# Altium schematic sheet WS485H-V5_RS.SchDoc: WS485H-V1
size A2; Author: Fred; PageSetup: Record=PageOptions|CenterHorizontal=True|CenterVertical=True|PrintScale=1.04|XCorrection=1.00|YCorrection=1.00|PrintKind=0|BorderSize=5000000|LeftOffset=0|BottomOffset=0|Orientation=1|PaperLength=1000|PaperWidth=1000|Scale=100|PaperSource=7|PrintQuality=-4|MediaType=1|DitherType=10|PaperKind=A3|PrintScaleMode=1
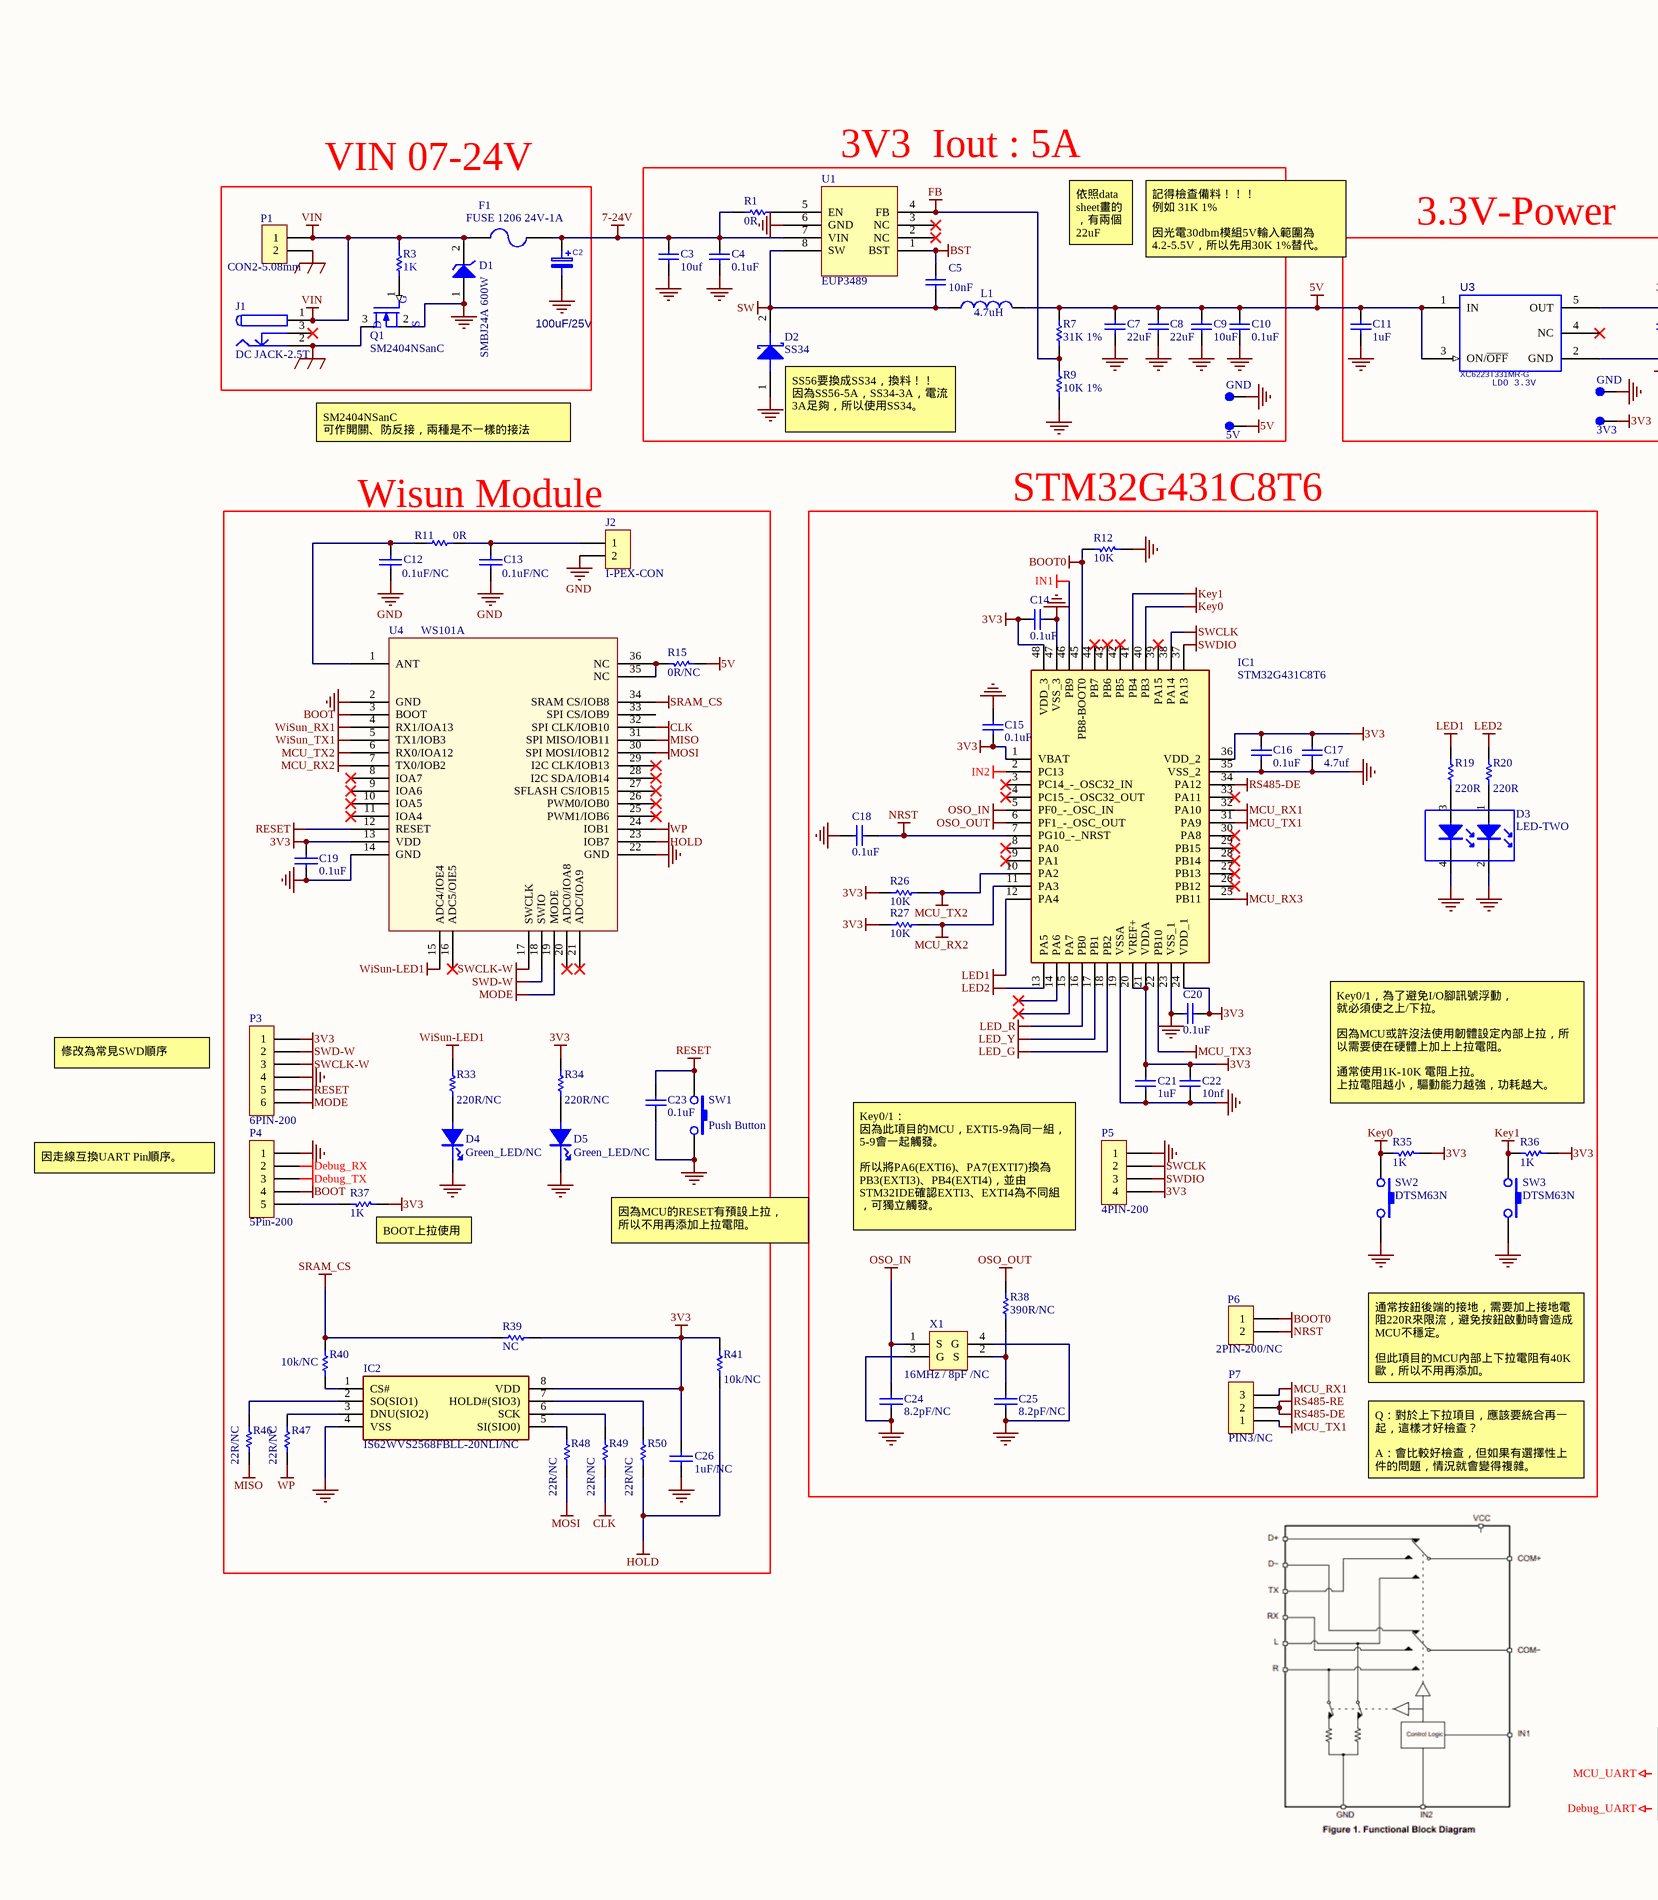
[diagram p0: WS485H-V5_RS.SchDoc, left]
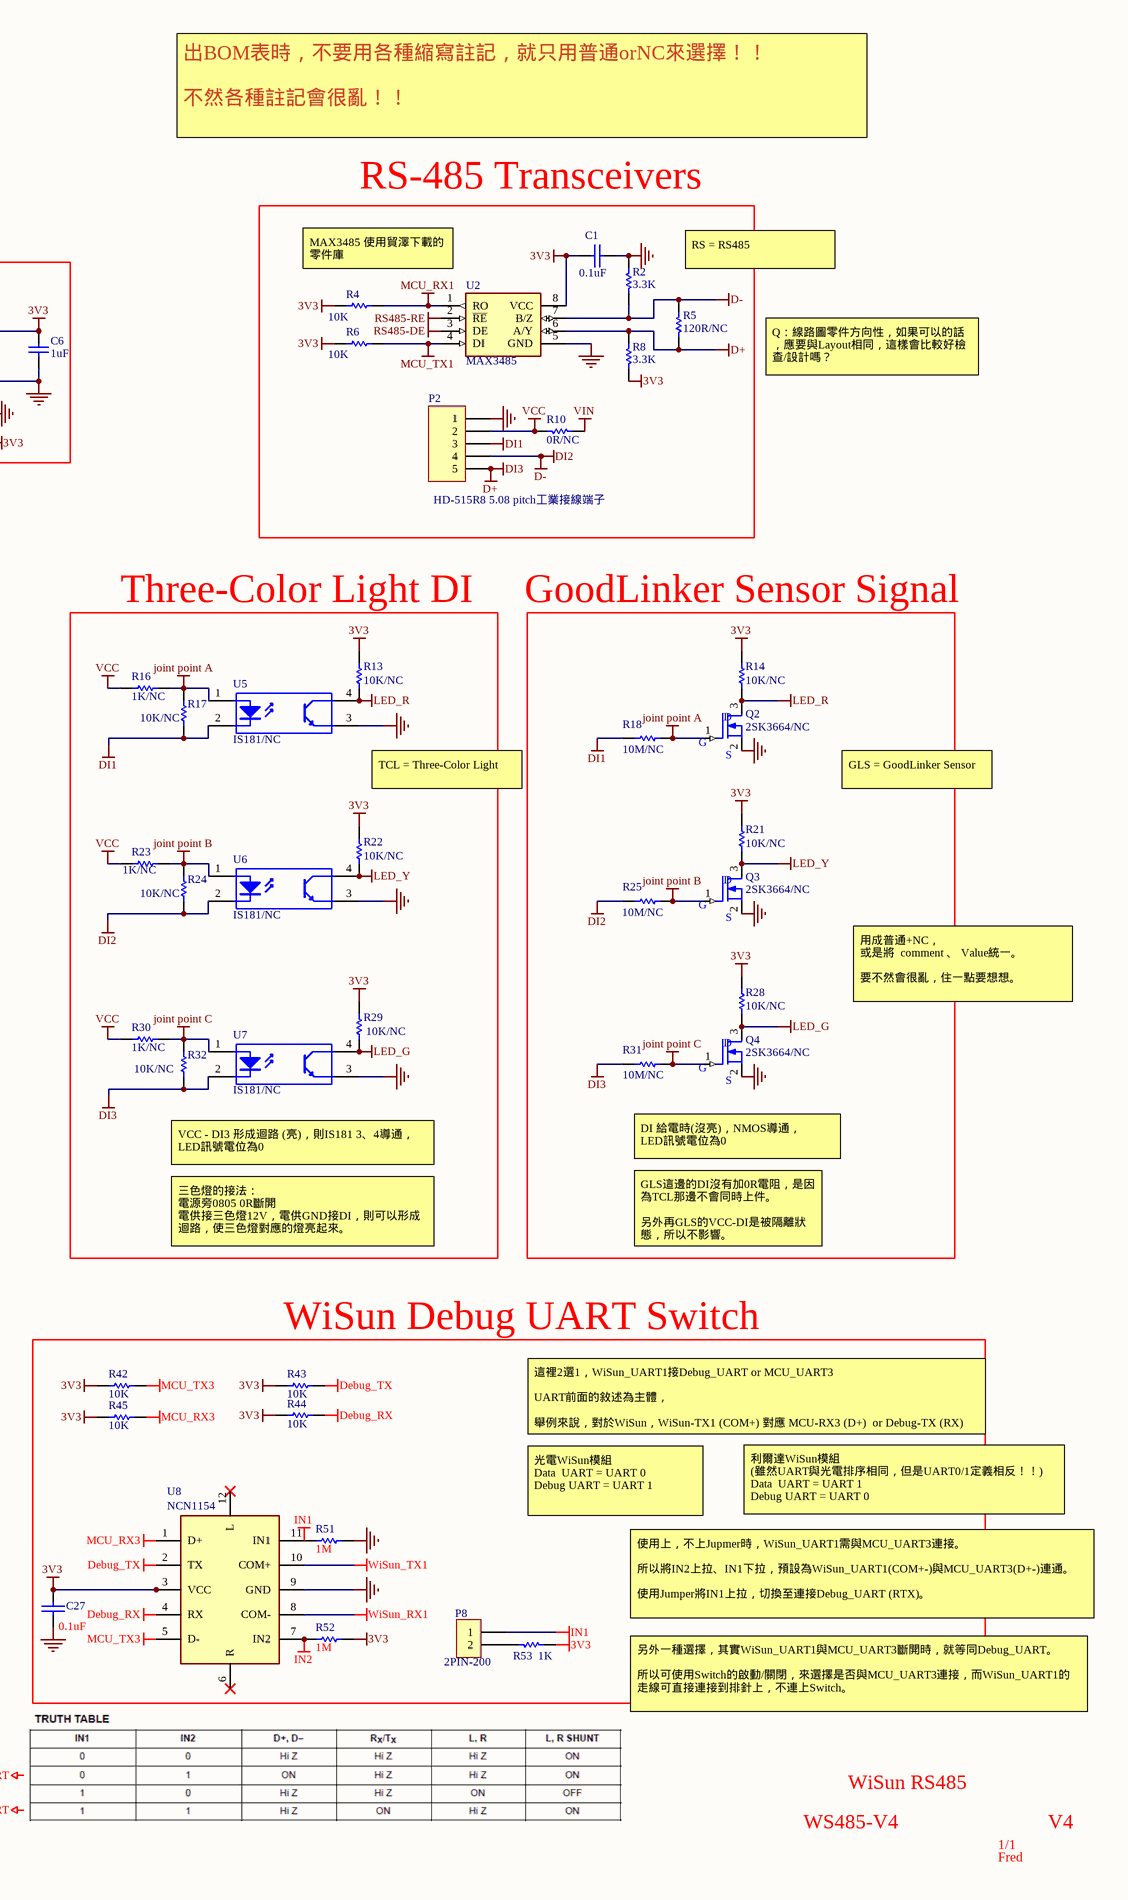
[diagram p1: WS485H-V5_RS.SchDoc, right]

## Parts
=Value1  GND  [TESTPAD-1.5X0.6MM]
=Value2  GND  [TESTPAD-1.5X0.6MM]
=Value3  3V3  [TESTPAD-1.5X0.6MM]
=Value4  5V  [TESTPAD-1.5X0.6MM]
C1  0.1uF  [0402C]
C2  100uF/25V  [DIP CAP-8*3.5]
C3  10uf  [0603C]
C4  0.1uF  [0603C]
C5  10nF  [0603C]
C6  1uF  [0603C]
C7  22uF  [0805C]
C8  22uF  [0805C]
C9  10uF  [0603C]
C10  0.1uF  [0603C]
C11  1uF  [0603C]
C12  0.1uF/NC  [0402C]
C13  0.1uF/NC  [0402C]
C14  0.1uF  [0402C]
C15  0.1uF  [0402C]
C16  0.1uF  [0402C]
C17  4.7uf  [0402C]
C18  0.1uF  [0402C]
C19  0.1uF  [0402C]
C20  0.1uF  [0402C]
C21  1uF  [0402C]
C22  10nf  [0402C]
C23  0.1uF  [0402C]
C24  8.2pF/NC  [0402C]
C25  8.2pF/NC  [0402C]
C26  1uF/NC  [0402C]
C27  0.1uF  [0402C]
D1  SMBJ24A 600W  [SMBJ40CA(TVS)]
D2  SS34  [SMBJ40CA(TVS)]
D3  LED-TWO  [LEDX2HOLD]
D4  Green_LED/NC  [LED0603--0.4mm]
D5  Green_LED/NC  [LED0603--0.4mm]
F1  FUSE 1206 24V-1A  [1206-FUSE]
IC1  STM32G431C8T6  [QFP50P900X900X160-48N]
IC2  IS62WVS2568FBLL-20NLI/NC  [SOIC127P600X175-8N]
J1  DC JACK-2.5T  [DC JACK-2.5T-NEW]
J2  I-PEX-CON  [I-PEX-CON]
L1  4.7uH  [L7X6.6]
P1  CON2-5.08mm  [OQ5.08-90D-2P]
P2  HD-515R8 5.08 pitch工業接線端子  [OQ5.08-90D-5P]
P3  6PIN-200  [6pin-200_1.3_0.6]
P4  5Pin-200  [5pin-200_1.3_0.6]
P5  4PIN-200  [4PIN-200_1.3_0.6]
P6  2PIN-200/NC  [2PIN-200_1.3_0.6]
P7  PIN3/NC  [3PIN-200_1.3_0.6]
P8  2PIN-200  [2PIN-200_1.3_0.6]
Q1  SM2404NSanC  [SOT-23]
Q2  2SK3664/NC  [SOT-23]
Q3  2SK3664/NC  [SOT-23]
Q4  2SK3664/NC  [SOT-23]
R1  0R  [0603]
R2  3.3K  [0603]
R3  1K  [0603]
R4  10K  [0402]
R5  120R/NC  [0603]
R6  10K  [0402]
R7  31K 1%  [0603]
R8  3.3K  [0603]
R9  10K 1%  [0603]
R10  0R/NC  [0805]
R11  0R  [0603]
R12  10K  [0402]
R13  10K/NC  [0402]
R14  10K/NC  [0402]
R15  0R/NC  [0805]
R16  1K/NC  [0402]
R17  10K/NC  [0402]
R18  10M/NC  [0402]
R19  220R  [0603]
R20  220R  [0603]
R21  10K/NC  [0402]
R22  10K/NC  [0402]
R23  1K/NC  [0402]
R24  10K/NC  [0402]
R25  10M/NC  [0402]
R26  10K  [0402]
R27  10K  [0402]
R28  10K/NC  [0402]
R29  10K/NC  [0402]
R30  1K/NC  [0402]
R31  10M/NC  [0402]
R32  10K/NC  [0402]
R33  220R/NC  [0402]
R34  220R/NC  [0402]
R35  1K  [0402]
R36  1K  [0402]
R37  1K  [0402]
R38  390R/NC  [0402]
R39  NC  [0402]
R40  10k/NC  [0402]
R41  10k/NC  [0402]
R42  10K  [0402]
R43  10K  [0402]
R44  10K  [0402]
R45  10K  [0402]
R46  22R/NC  [0402]
R47  22R/NC  [0402]
R48  22R/NC  [0402]
R49  22R/NC  [0402]
R50  22R/NC  [0402]
R51  1M  [0402]
R52  1M  [0402]
R53  1K  [0402]
SW1  Push Button  [Button_2pin-3*4*2MM]
SW2  DTSM63N  [SW-AT-1102VT1-new]
SW3  DTSM63N  [SW-AT-1102VT1-new]
U1  EUP3489  [MOS SOP8]
U2  MAX3485  [SOIC127P600X175-8N]
U3  XC6223T331MR-G  [SOT-23-5-0.95MM]
U4  WS101A  [WS101A]
U5  IS181/NC  [IS181-SMD]
U6  IS181/NC  [IS181-SMD]
U7  IS181/NC  [IS181-SMD]
U8  NCN1154  [IC_TXB0104RUTR]
X1  16MHz / 8pF /NC  [XTAL-SMD-20*16]

## Blocks framed on the sheet
VIN 07-24V: C2 D1 F1 J1 P1 Q1 R3
3V3  Iout : 5A: =Value2 =Value4 C3-C5 C7-C10 D2 L1 R1 R7 R9 U1
RS-485 Transceivers: C1 P2 R2 R4-R6 R8 R10 U2
3.3V-Power: =Value1 =Value3 C6 C11 U3
Wisun Module: C12 C13 C19 C23 C26 D4 D5 IC2 J2 P3 P4 R11 R15 R33 R34 R37 R39-R41 R46-R50 SW1 U4
STM32G431C8T6: C14-C18 C20-C22 C24 C25 D3 IC1 P5-P7 R12 R19 R20 R26 R27 R35 R36 R38 SW2 SW3 X1
Three-Color Light DI: R13 R16 R17 R22-R24 R29 R30 R32 U5-U7
WiSun Debug UART Switch: C27 P8 R42-R45 R51-R53 U8

## Nets
3V3: =Value3.1 C1.2 C6.2 C14.2 C15.2 C16.1 C17.1 C19.2 C20.2 C21.1 C22.1 C26.2 C27.1 IC1.1(VBAT) IC1.20(VREF+) IC1.21(VDDA) IC1.24(VDD_1) IC1.36(VDD_2) IC1.48(VDD_3) IC2.8(VDD) P3.1 P5.4 R4.2 R6.2 R8.2 R13.2 R14.2 R21.2 R22.2 R26.2 R27.2 R28.2 R29.2 R34.2 R35.1 R36.1 R37.1 R39.1 R41.2 R42.2 R43.2 R44.2 R45.2 R52.1 R53.1 U2.8(VCC) U3.5(OUT) U4.13(VDD) U8.3(VCC)
5V: =Value4.1 C7.2 C8.2 C9.2 C10.2 C11.2 L1.2 R7.2 R15.1 U3.1(IN) U3.3(ON/~{OFF})
7-24V: C2.1 C3.2 C4.2 F1.2 R1.1 U1.7(VIN)
BOOT: P4.4 U4.3(BOOT)
BOOT0: IC1.45(PB8-BOOT0) P6.1 R12.2
BST: C5.1 U1.1(BST)
CLK: R49.1 U4.32(SPI_CLK/IOB10)
D+: P2.5 R5.2 R8.1 R31.2 R32.1 U2.6(A/Y) U7.2  [also labelled DI3]
D-: P2.4 R2.2 R5.1 R24.1 R25.2 U2.7(B/Z) U6.2  [also labelled DI2]
Debug_RX: P4.2 R44.1 U8.4(RX)
Debug_TX: P4.3 R43.1 U8.2(TX)
DI1: P2.3 R17.1 R18.2 U5.2
FB: R7.1 R9.2 U1.4(FB)
GND: =Value1.1 =Value2.1 C1.1 C2.2 C3.1 C4.1 C6.1 C7.1 C8.1 C9.1 C10.1 C11.1 C12.1 C13.1 C14.1 C15.1 C16.2 C17.2 C18.2 C19.1 C20.1 C21.2 C22.2 C23.2 C24.2 C25.2 C26.1 C27.2 D1.1 D2.1 D3.2 D3.4 D4.2 D5.2 IC1.19(VSSA) IC1.23(VSS_1) IC1.35(VSS_2) IC1.47(VSS_3) IC2.4(VSS) J2.2 P2.1 P3.4 P4.1 P5.1 Q1.2(SOURCE) Q2.2(SOURCE) Q3.2(SOURCE) Q4.2(SOURCE) R2.1 R9.1 R12.1 R51.1 SW1.2 SW2.0(GND) SW2.2 SW3.0(GND) SW3.2 U1.6(GND) U2.5(GND) U3.2(GND) U4.2(GND) U4.14(GND) U4.22(GND) U5.3 U6.3 U7.3 U8.9(GND) X1.3(G) X1.4(G)
HOLD: R41.1 R50.1 U4.23(IOB7)
IN1: IC1.46(PB9) P8.1 R51.2 U8.11(IN1)
IN2: IC1.2(PC13) R52.2 U8.7(IN2)
joint point A: Q2.1(GATE) R16.2 R17.2 R18.1 U5.1
joint point B: Q3.1(GATE) R23.2 R24.2 R25.1 U6.1
joint point C: Q4.1(GATE) R30.2 R31.1 R32.2 U7.1
Key0: IC1.40(PB3) R35.2 SW2.1
Key1: IC1.41(PB4) R36.2 SW3.1
LED1: IC1.12(PA4) R19.2
LED2: IC1.13(PA5) R20.2
LED_G: IC1.18(PB2) Q4.3(DRAIN) R28.1 R29.1 U7.4
LED_R: IC1.16(PB0) Q2.3(DRAIN) R13.1 R14.1 U5.4
LED_Y: IC1.17(PB1) Q3.3(DRAIN) R21.1 R22.1 U6.4
MCU_RX1: IC1.32(PA10) P7.3 R4.1 U2.1(RO)
MCU_RX2: IC1.11(PA3) R27.1 U4.7(TX0/IOB2)
MCU_RX3: IC1.25(PB11) R45.1 U8.1(D+)
MCU_TX1: IC1.31(PA9) P7.1 R6.1 U2.4(DI)
MCU_TX2: IC1.10(PA2) R26.1 U4.6(RX0/IOA12)
MCU_TX3: IC1.22(PB10) R42.1 U8.5(D-)
MISO: R46.2 U4.31(SPI_MISO/IOB11)
MODE: P3.6 U4.19(MODE)
MOSI: R48.1 U4.30(SPI_MOSI/IOB12)
NRST: C18.1 IC1.7(PG10_-_NRST) P6.2
OSO_IN: C24.1 IC1.5(PF0_-_OSC_IN) X1.1(S)
OSO_OUT: IC1.6(PF1_-_OSC_OUT) R38.1
PGND: J1.2 P1.2 Q1.3(DRAIN)
RESET: C23.1 P3.5 SW1.1 U4.12(RESET)
RS485-DE: IC1.34(PA12) P7.2 U2.2(~{RE}) U2.3(DE)  [also labelled RS485-RE]
SRAM_CS: R39.2 R40.1 U4.34(SRAM_CS/IOB8)
SW: C5.2 D2.2 L1.1 U1.8(SW)
SWCLK: IC1.38(PA14) P5.2
SWCLK-W: P3.3 U4.17(SWCLK)
SWD-W: P3.2 U4.18(SWIO)
SWDIO: IC1.37(PA13) P5.3
VCC: P2.2 R10.2 R16.1 R23.1 R30.1
VIN: D1.2 F1.1 J1.1 P1.1 R3.2 R10.1
WiSun-LED1: R33.2 U4.15(ADC4/IOE4)
WiSun_RX1: U4.4(RX1/IOA13) U8.8(COM-)
WiSun_TX1: U4.5(TX1/IOB3) U8.10(COM+)
WP: R47.1 U4.24(IOB1)
NetC12_2: C12.2 R11.1 U4.1(ANT)
NetC13_2: C13.2 J2.1 R11.2
NetC25_1: C25.1 R38.2 X1.2(S)
NetD3_1: D3.1 R20.1
NetD3_3: D3.3 R19.1
NetD4_1: D4.1 R33.1
NetD5_1: D5.1 R34.1
NetIC2_1: IC2.1(CS#) R40.2
NetIC2_2: IC2.2(SO(SIO1)) R46.1
NetIC2_3: IC2.3(DNU(SIO2)) R47.2
NetIC2_5: IC2.5(SI(SIO0)) R48.2
NetIC2_6: IC2.6(SCK) R49.2
NetIC2_7: IC2.7(HOLD#(SIO3)) R50.2
NetP4_5: P4.5 R37.2
NetP8_2: P8.2 R53.2
NetQ1_1: Q1.1(GATE) R3.1
NetR1_2: R1.2 U1.5(EN)
NetR15_2: R15.2 U4.35(NC) U4.36(NC)

Not connected (* = marked no-connect by the designer): IC1 3(PC14_-_OSC32_IN)* 4(PC15_-_OSC32_OUT)* 8(PA0)* 9(PA1)* 14(PA6)* 15(PA7)* 26(PB12)* 27(PB13)* 28(PB14)* 29(PB15)* 30(PA8)* 33(PA11)* 39(PA15)* 42(PB5)* 43(PB6)* 44(PB7)*; J1 3*; U1 2(NC)* 3(NC)*; U3 4(NC)*; U4 8(IOA7)* 9(IOA6)* 10(IOA5)* 11(IOA4)* 16(ADC5/OIE5)* 20(ADC0/IOA8)* 21(ADC/IOA9)* 25(PWM1/IOB6)* 26(PWM0/IOB0)* 27(SFLASH_CS/IOB15)* 28(I2C_SDA/IOB14)* 29(I2C_CLK/IOB13)* 33(SPI_CS/IOB9); U8 6(R)* 12(L)*

## Notes on the sheet
- 出BOM表時，不要用各種縮寫註記，就只用普通orNC來選擇！！
  不然各種註記會很亂！！
- 依照data sheet畫的，有兩個22uF
- 記得檢查備料！！！
  例如 31K 1%
  因光電30dbm模組5V輸入範圍為4.2-5.5V，所以先用30K 1%替代。
- MAX3485 使用貿澤下載的零件庫
- RS = RS485
- 注意事項！！！！！
  WS101A 沒用到的pin原本的零件庫有畫錯
  RS485料號要改！！！ ISL3178EIBZ-T
  0603 120K 1% 改為 127K 1%，輸出為3.32V 正常 ！！！
- (near U3) LDO 3.3V
- Q：線路圖零件方向性，如果可以的話，應要與Layout相同，這樣會比較好檢查/設計嗎？
- SM2404NSanC
  可作開關、防反接，兩種是不一樣的接法
- (near D2) SS56要換成SS34，換料！！
  因為SS56-5A，SS34-3A，電流3A足夠，所以使用SS34。
- (near =Value4) 22uF 雖然0603有料，不過0805比較便宜！！
- "Si2306DS" 換料成 "SM2404NSanC"
- GoodLinker Sensor Signal
- TCL = Three-Color Light
- GLS = GoodLinker Sensor
- 用成普通+NC，
  或是將  comment 、 Value統一。
  要不然會很亂，住一點要想想。
- 修改為常見SWD順序
- Key0/1，為了避免I/O腳訊號浮動，
  就必須使之上/下拉。
  因為MCU或許沒法使用韌體設定內部上拉，所以需要使在硬體上加上上拉電阻。
  通常使用1K-10K 電阻上拉。
  上拉電阻越小，驅動能力越強，功耗越大。
- VCC - DI3 形成迴路 (亮)，則IS181 3、4導通，
  LED訊號電位為0
- DI 給電時(沒亮)，NMOS導通，
  LED訊號電位為0
- 因走線互換UART Pin順序。
- Key0/1：
  因為此項目的MCU，EXTI5-9為同一組，5-9會一起觸發。
  所以將PA6(EXTI6)、PA7(EXTI7)換為PB3(EXTI3)、PB4(EXTI4)，並由STM32IDE確認EXTI3、EXTI4為不同組，可獨立觸發。
- (near R37) BOOT上拉使用
- 因為MCU的RESET有預設上拉，
  所以不用再添加上拉電阻。
- 三色燈的接法：
  電源旁0805 0R斷開
  電供接三色燈12V，電供GND接DI，則可以形成迴路，使三色燈對應的燈亮起來。
- GLS這邊的DI沒有加0R電阻，是因為TCL那邊不會同時上件。
  另外再GLS的VCC-DI是被隔離狀態，所以不影響。
- 通常按鈕後端的接地，需要加上接地電阻220R來限流，避免按鈕啟動時會造成MCU不穩定。
  但此項目的MCU內部上下拉電阻有40K歐，所以不用再添加。
- 這裡2選1，WiSun_UART1接Debug_UART or MCU_UART3
  UART前面的敘述為主體，
  舉例來說，對於WiSun，WiSun-TX1 (COM+) 對應 MCU-RX3 (D+)  or Debug-TX (RX)
- Q：對於上下拉項目，應該要統合再一起，這樣才好檢查？
  A：會比較好檢查，但如果有選擇性上件的問題，情況就會變得複雜。
- 光電WiSun模組
  Data  UART = UART 0
  Debug UART = UART 1
- 利爾達WiSun模組
  (雖然UART與光電排序相同，但是UART0/1定義相反！！)
  Data  UART = UART 1
  Debug UART = UART 0
- 使用上，不上Jupmer時，WiSun_UART1需與MCU_UART3連接。
  所以將IN2上拉、IN1下拉，預設為WiSun_UART1(COM+-)與MCU_UART3(D+-)連通。
  使用Jumper將IN1上拉，切換至連接Debug_UART (RTX)。
- Q：這裡有個小問題，上拉電阻要加在COM+-端還是D+-/RTX端？
  A：考慮訊號最穩定的情況的，加在D+-/RTX端較佳，沒被Switch選中時，訊號也不會是浮動的。
  而考慮面積的話，則是加在COM+-端。
- 註解快捷鍵：P+E+O
- 問題：
  ．12V保險絲為何用1A & 為何要保險絲
  ．關於RS485，D+D-中間為何要有個NC電阻
- 另外一種選擇，其實WiSun_UART1與MCU_UART3斷開時，就等同Debug_UART。
  所以可使用Switch的啟動/關閉，來選擇是否與MCU_UART3連接，而WiSun_UART1的走線可直接連接到排針上，不連上Switch。
- 優先製作高價版，以Z200為基本。
  RS485、三色燈用成二選一。
  另外需製作低價版的。
- WiSun RS485
- 參考列表：
  connecter部分：Z200-485-J-R2
  電供部分：YJF-MB03(主機)、YJF-KTC02(溫度版)
  Wisun Module：WSCB-V2(WiSun底板)
  RS-485 Transceivers：YJF-MB03(主機)
  三色燈DI：QGW810-V5
  STM32F301C8T6：QGW810-V5
- WS485-V4
- 1/1
- Fred
- V4
- Labels drawn without touching a wire or pin: Debug_UART, MCU_UART
- (in symbol MOSFET N-1) G; D; S

## Library data of the parts
=Value1-=Value4 = TP: Test point
  =Value1 =Value2: Value: GND
  =Value3: Value: 3V3
  =Value4: Value: 5V
C1 C12 C13 C19 C24-C27 = CAP: Capacitor
  C1 C19 C27: Value: 0.1uF
  C12 C13: Value: 0.1uF/NC
  C24 C25: Value: 8.2pF/NC
  C26: Value: 1uF/NC
C2 = C POL: Part Number: 53300833000; Right: 20; Tolerance: 20%; Rating: 10V; Package Height: 1.8mm; PCB_x: 19.129500; PCB_y: 12.184000; PCB_dir: 0.000000; PCB_loc: Top; Bottom: 20; Value: 100uF/25V
C3 C7-C10 = Cap Semi: Capacitor
  C3: Published: 8-Jun-2000; LatestRevisionDate: 17-Jul-2002; LatestRevisionNote: Re-released for DXP Platform.; PackageReference: C1206; Publisher: Altium Limited; Value: 10uf
  C7 C8: Value: 22uF
  C9: Value: 10uF
  C10: Value: 0.1uF
C4-C6 C11 C14-C18 C20-C23 = Cap Semi: Capacitor (Semiconductor SIM Model); Published: 8-Jun-2000; LatestRevisionDate: 17-Jul-2002; LatestRevisionNote: Re-released for DXP Platform.; PackageReference: C1206; Publisher: Altium Limited
  C4 C14-C16 C18 C20 C23: Value: 0.1uF
  C5: Value: 10nF
  C6 C11 C21: Value: 1uF
  C17: Value: 4.7uf
  C22: Value: 10nf
D1 = PESD5V0L1BA: Zener Diode; Value: SMBJ24A 600W
D2 = SS34: Schottky Diode; Value: SS34
D4 D5 = LED: Manufacturer's Part Number: CL-170G-CD-T; Part Number: 41100017000; Manufacturer: Citizen; Old Part Number: 4317000; Right: 40; Bottom: 20; Package Height: 1.1mm; FPLIST: mot/0805LED,dig/0805led; PCB_x: 46.095000; PCB_y: 6.420000; PCB_dir: 90.000000; Value: Green_LED/NC; Cost: 0.48
F1 = FUSE2: Fuse; Value: FUSE 1206 24V-1A
IC1 = STM32G431C8T6: Integrated Circuit; Manufacturer_Name: STMicroelectronics; Datasheet Link: https://www.arrow.com/en/products/stm32g431c8t6/stmicroelectronics; Height: 1.6mm; Manufacturer_Part_Number: STM32G431C8T6; Value: STM32G431C8T6
IC2 = IS62WVS2568FBLL-20NLI: Integrated Circuit; Manufacturer_Name: Integrated Silicon Solution Inc.; Datasheet Link: https://componentsearchengine.com//IS62WVS2568FBLL-20NLI.pdf; Height: 1.75mm; Mouser2 Part Number: 870-WVS2568FBLL20NLI; Mouser2 Price/Stock: https://www.mouser.com/Search/Refine.aspx?Keyword=870-WVS2568FBLL20NLI; Manufacturer_Part_Number: IS62WVS2568FBLL-20NLI; Value: IS62WVS2568FBLL-20NLI/NC
J1 = DCJACK-1: Low Voltage Power Supply Connector; Published: *; DatasheetDocument: *; Publisher: *; ComponentLink1Description: *; ComponentLink1URL: *; Value: DC JACK-2.5T
J2 P1 P6 P8 = CON2: Connector
  J2: Value: I-PEX-CON
  P1: Value: CON2-5.08mm
  P6: Value: 2PIN-200/NC
  P8: Value: 2PIN-200
L1 = Inductor: Code_IEC: 1005; Published: 8-Jun-2000; LatestRevisionDate: 17-Jul-2002; LatestRevisionNote: Re-released for DXP Platform.; PackageReference: 0402-A; Publisher: Altium Limited; Code_JEITA: 0402; Value: 4.7uH
P2 = Header 5: Header, 5-Pin; LatestRevisionDate: 17-Jul-2002; LatestRevisionNote: Re-released for DXP Platform.; Publisher: Altium Limited; Value: HD-515R8 5.08 pitch工業接線端子
P3 = 6PIN-200: Pin Header; LatestRevisionDate: 17-Jul-2002; LatestRevisionNote: Re-released for DXP Platform.; Publisher: Altium Limited; Value: 6PIN-200
P4 = PIN5: Value: 5Pin-200
P5 = CON4: Connector; Value: 4PIN-200
P7 = PIN3: Connector; Value: PIN3/NC
Q1-Q4 = MOSFET N-1: N-Channel Mosfet
  Q1: Value: SM2404NSanC
  Q2-Q4: Value: 2SK3664/NC
R1-R53 = Res Semi: Semiconductor Resistor; Published: 8-Jun-2000; LatestRevisionDate: 17-Jul-2002; LatestRevisionNote: Re-released for DXP Platform.; PackageReference: AXIAL-0.5; Publisher: Altium Limited
  R1 R11: Value: 0R
  R2 R8: Value: 3.3K
  R3 R35-R37 R53: Value: 1K
  R4 R6 R12 R26 R27 R42-R45: Value: 10K
  R5: Value: 120R/NC
  R7: Value: 31K 1%
  R9: Value: 10K 1%
  R10 R15: Value: 0R/NC
  R13 R14 R17 R21 R22 R24 R28 R29 R32: Value: 10K/NC
  R16 R23 R30: Value: 1K/NC
  R18 R25 R31: Value: 10M/NC
  R19 R20: Value: 220R
  R33 R34: Value: 220R/NC
  R38: Value: 390R/NC
  R39: Value: NC
  R40 R41: Value: 10k/NC
  R46-R50: Value: 22R/NC
  R51 R52: Value: 1M
SW1-SW3 = SW1
  SW1: Value: Push Button
  SW2 SW3: Value: DTSM63N
U1 = EUP3489: DC-DC  Buck 5A,30V; Value: EUP3489
U2 = ISL3178EIBZ-T: Integrated Circuit; Manufacturer_Name: Renesas Electronics; Datasheet Link: https://www.renesas.com/en-us/www/doc/datasheet/isl3170e-71e-72e-73e-74e-75e-76e-77e-78e.pdf; Height: 1.75mm; Manufacturer_Part_Number: ISL3178EIBZ-T; Value: MAX3485
U5-U7 = Optoisolator1: 4-Pin Phototransistor Optocoupler; Published: 24-Mar-1999; LatestRevisionDate: 04-Mar-2005; LatestRevisionNote: Sch pins 3 & 4 Swapped.; DatasheetDocument: Nov-2003; PackageReference: DIP-4; Publisher: Altium Limited; Value: IS181/NC
U8 = NCN1154: MP: TXB0104RUTR; MF: Texas Instruments; Digi-Key_Part_Number: 296-25888-1-ND; SnapEDA_Link: https://www.snapeda.com/parts/TXB0104RUTR/Texas%20Instruments/view-part/44415/?ref=snap; Package: UQFN-12 Texas Instruments; Value: NCN1154; Digi-Key_Purchase_URL: https://www.digikey.com/product-detail/en/texas-instruments/TXB0104RUTR/296-25888-1-ND/2242752?utm_source=snapeda&utm_medium=aggregator&utm_campaign=symbol
X1 = XTAL-SMD-25*32: Value: 16MHz / 8pF /NC
D3 = LED-TWO: Value: LED-TWO
U3 = XC6223T331MR-G: Value: XC6223T331MR-G
U4 = WS101A: Value: WS101A